# EAGLE design remote_controller (EAGLE 9.0.1)
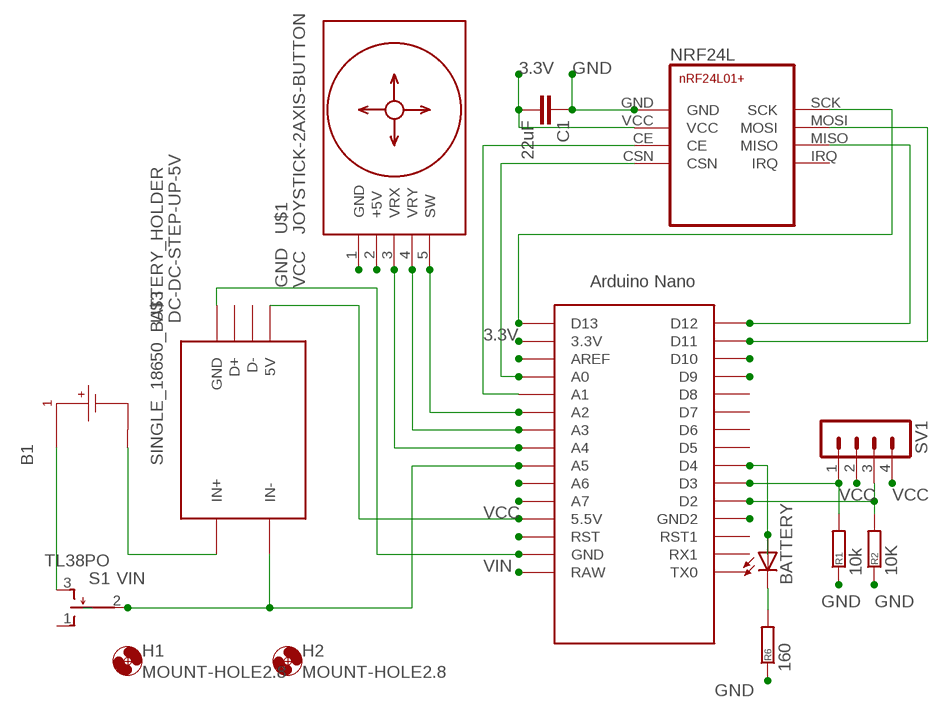
[diagram p0: schematic, sheet 1]

## Parts
B1  SINGLE_18650_BATTERY_HOLDER  [SINGLE_18650_HOLDER]
BATTERY  LED5MM  [LED5MM]
C1  22uF  C-EU025-040X050  [C025-040X050]
H1  MOUNT-HOLE2.8  [2,8]
H2  MOUNT-HOLE2.8  [2,8]
NRF24L  NRF24L01+  [NRF24L01+]
R1  10k  R-EU_0204/7  [0204/7]
R2  10K  R-EU_0204/7  [0204/7]
R6  160  R-EU_0204/7  [0204/7]
S1  TL38PO  [TL3XPO]
SV1  MA04-1  [MA04-1]
U$1  JOYSTICK-2AXIS-BUTTON  [JOYSTICK-2AXIS-BUTTON]
U$2  NANO  [NANO]
U$3  DC-DC-STEP-UP-5V  [DC-DC-STEP-UP-5V]

## Nets
3.3V: C1.2 NRF24L.VCC U$2.3.3V
A0: NRF24L.CSN U$2.A0
A1: NRF24L.CE U$2.A1
A2: U$1.5(SW) U$2.A2
A3: U$1.4(VRY) U$2.A3
A4: U$1.3(VRX) U$2.A4
D2: R2.2 SV1.3 U$2.D2
D3: R1.2 SV1.1 U$2.D3
D4: BATTERY.A U$2.D4
D9: U$2.D9
D10: U$2.D10
D11: NRF24L.MOSI U$2.D11
D12: NRF24L.MISO U$2.D12
D13: NRF24L.SCK U$2.D13
GND: C1.1 NRF24L.GND R1.1 R2.1 R6.1 U$1.1(GND) U$2.GND U$2.GND1(GND2) U$3.GND
N$3: B1.C1_N(1_N) U$3.IN+
N$12: B1.C1_P(1_P) S1.3(S)
N$16: BATTERY.K(C) R6.2
N$18: U$2.RST
N$20: U$2.A7
N$21: U$2.A6
N$30: U$2.AREF
VCC: SV1.2 SV1.4 U$1.2(+5V) U$2.5V(5.5V) U$3.5V
VIN: S1.2(P) U$2.A5 U$2.RAW U$3.IN-
Unconnected: NRF24L.IRQ S1.1(O) U$2.D5 U$2.D6 U$2.D7 U$2.D8 U$2.RST1 U$2.RX1 U$2.TX0 U$3.D+ U$3.D-

## Library data of the parts
B1 = dd_18650:SINGLE_18650_BATTERY_HOLDER: Keystone Electronics 18650 Battery Holder; MANUF: Keystone Electronics; PARTNUM: 1049
BATTERY = dd_led:LED: LED OSRAM: - CHIPLED LG R971, LG N971, LY N971, LG Q971, LY Q971, LO R971, LY R971 LH N974, LH R974 LS Q976, LO Q976, LY Q976 LO Q996 - Hyper CHIPLED LW Q18S LB Q993, LB Q99A, LB R99A - SideLED LS A670, LO A670, LY A670, LG A670, LP A670 LB A673, LV A673, LT A673, LW A673 LH A674 LY A675 LS A676, LA A676, LO A676, LY A676, LW A676 LS A679, LY A679, LG A679 - Hyper Micro SIDELED® LS Y876, LA Y876, LO Y876, LY Y876 LT Y87S - SmartLED LW L88C, LW L88S LB L89C, LB L89S, LG L890 LS L89K, LO L89K, LY L89K LS L896, LA L896, LO L896, LY L896 - TOPLED LS T670, LO T670, LY T670, LG T670, LP T670 LSG T670, LSP T670, LSY T670, LOP T670, LYG T670 LG T671, LOG T671, LSG T671 LB T673, LV T673, LT T673, LW T673 LH T674 LS T676, LA T676, LO T676, LY T676, LB T676, LH T676, LSB T676, LW T676 LB T67C, LV T67C, LT T67C, LS T67K, LO T67K, LY T67K, LW E67C LS E67B, LA E67B, LO E67B, LY E67B, LB E67C, LV E67C, LT E67C LW T67C LS T679, LY T679, LG T679 LS T770, LO T770, LY T770, LG T770, LP T770 LB T773, LV T773, LT T773, LW T773 LH T774 LS E675, LA E675, LY E675, LS T675 LS T776, LA T776, LO T776, LY T776, LB T776 LHGB T686 LT T68C, LB T68C - Hyper Mini TOPLED® LB M676 - Mini TOPLED Santana® LG M470 LS M47K, LO M47K, LY M47K Source: http://www.osram.convergy.de LUXEON: - LUMILED® LXK2-PW12-R00, LXK2-PW12-S00, LXK2-PW14-U00, LXK2-PW14-V00 LXK2-PM12-R00, LXK2-PM12-S00, LXK2-PM14-U00 LXK2-PE12-Q00, LXK2-PE12-R00, LXK2-PE12-S00, LXK2-PE14-T00, LXK2-PE14-U00 LXK2-PB12-K00, LXK2-PB12-L00, LXK2-PB12-M00, LXK2-PB14-N00, LXK2-PB14-P00, LXK2-PB14-Q00 LXK2-PR12-L00, LXK2-PR12-M00, LXK2-PR14-Q00, LXK2-PR14-R00 LXK2-PD12-Q00, LXK2-PD12-R00, LXK2-PD12-S00 LXK2-PH12-R00, LXK2-PH12-S00 LXK2-PL12-P00, LXK2-PL12-Q00, LXK2-PL12-R00 Source: www.luxeon.com KINGBRIGHT: KA-3528ASYC Source: www.kingbright.com
C1 = dd_goldpin:C-EU: CAPACITOR, European symbol
H1 H2 = holes:MOUNT-HOLE: MOUNTING HOLE with drill center marker
NRF24L = dd_nrf:NRF24L01+: nRF24L01+ Transceiver Module
R1 R2 R6 = dd_resistor:R-EU_: RESISTOR, European symbol
S1 = dd_goldpin:TL38PO: TINY SWITCH ON OFF MOM Source: http://www2.produktinfo.conrad.com/datenblaetter/700000-724999/705152-da-01-de-Subminiaturschalter_TL_36YO.pdf
SV1 = dd_goldpin:MA04-1: PIN HEADER; OC_FARNELL: unknown; OC_NEWARK: unknown
U$1 = dd_stepup_joystick:JOYSTICK-2AXIS-BUTTON: 2-Axis Analog Joystick with Push Button Tutorial is available here: http://henrysbench.capnfatz.com/henrys-bench/arduino-sensors-and-input/arduino-ps2-joystick-tutorial-keyes-ky-023-deek-robot/ Click here to find device on ebay.com <http://www.ebay.com/sch/joystick+ps2+module>
U$2 = dd_nano:NANO: Arduino Nano
U$3 = dd_stepup_joystick:DC-DC-STEP-UP-5V: DC/DC Step-Up Converter

## Board
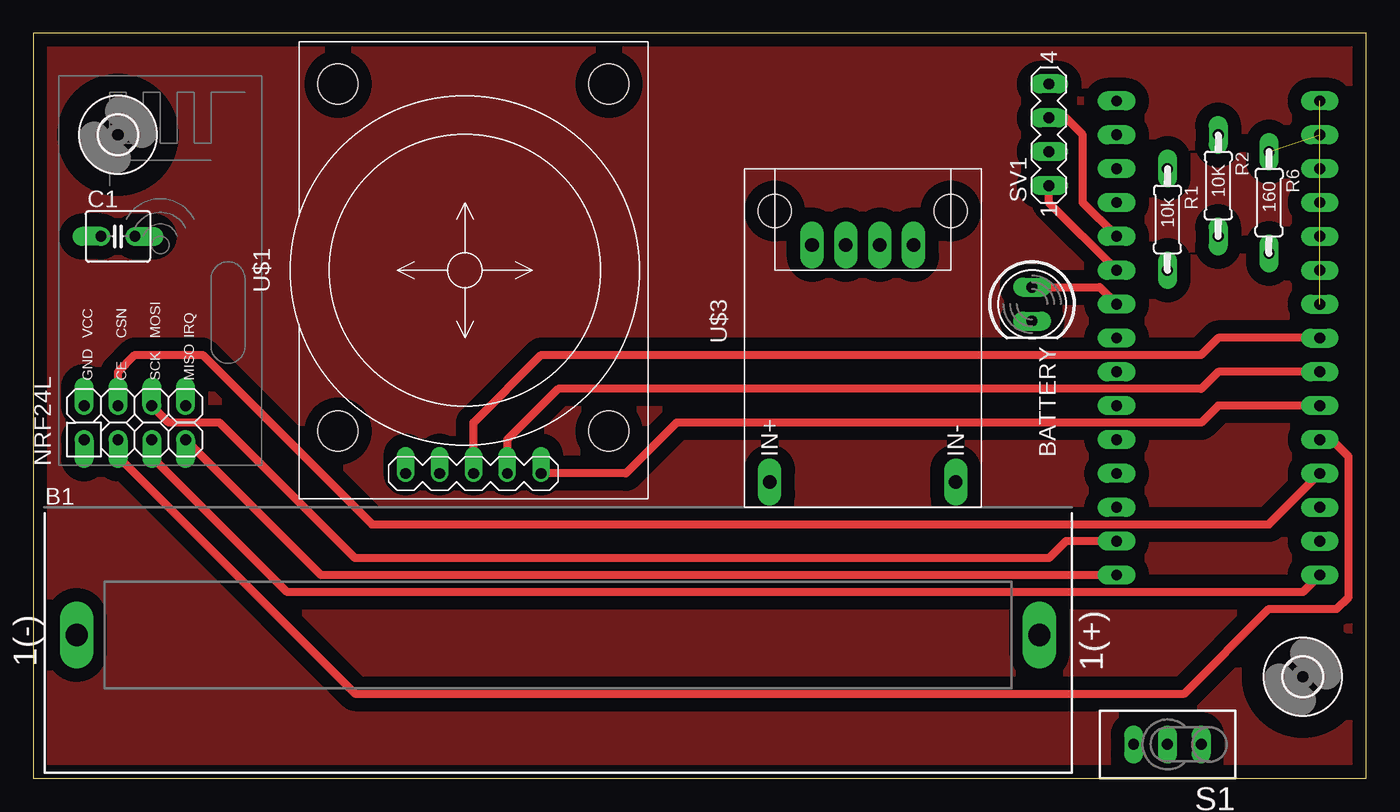
[diagram p1: board, top side]
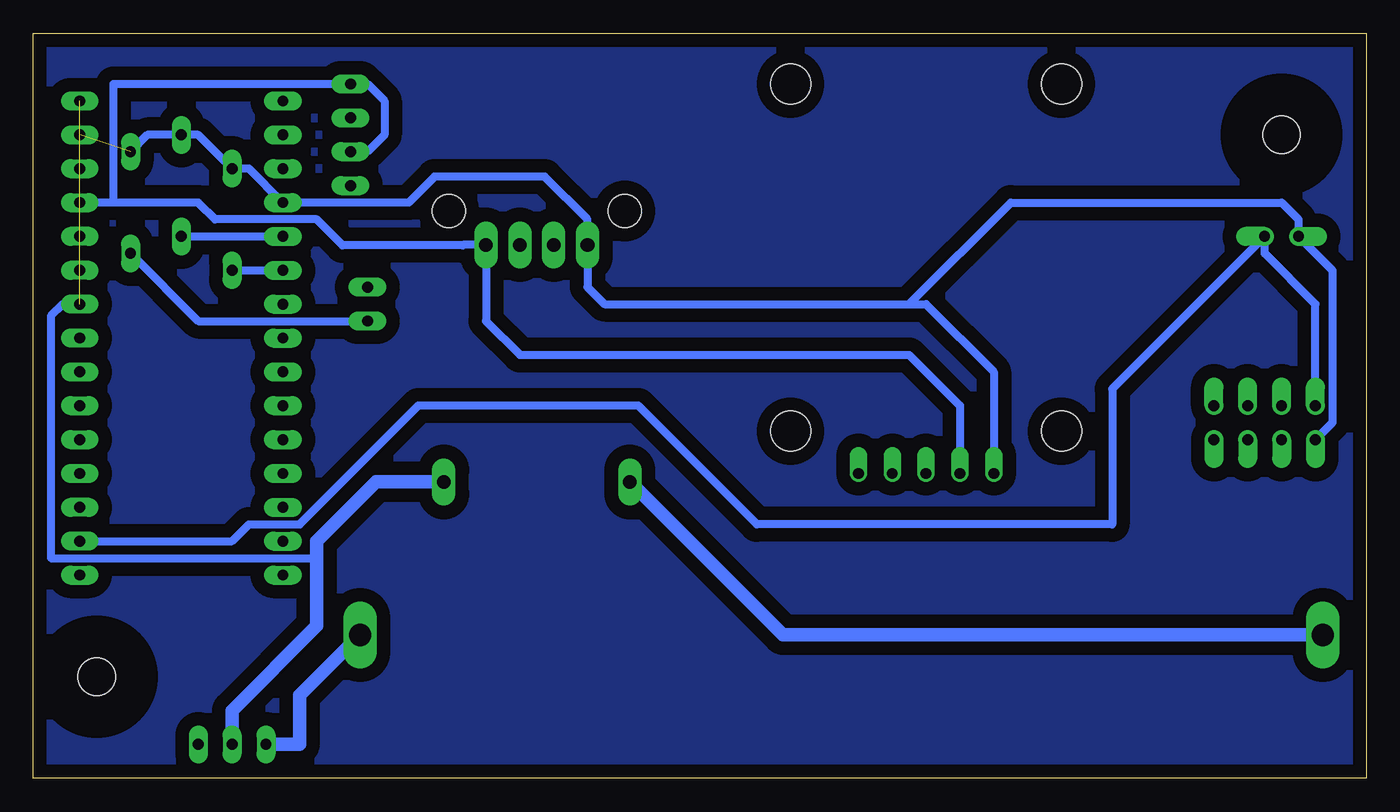
[diagram p2: board, bottom side, seen from below]

Size 100 x 55.87 mm. Coordinates in mm from the lower left corner, seen from the top.
Outline: 0,0 100,0 100,55.87 0,55.87 0,0
Copper layers (1*16): Top 0.035mm / dielectric 1.5mm / Bottom 0.035mm
Design rules "default": minimum track width 6mil, minimum drill 0.35mm, track to track 6mil, track to pad 6mil, pad to pad 6mil, via to via 6mil, smd to smd 6mil, copper to edge 40mil, drill to drill 6mil, minimum pad ring 10mil, minimum via ring 8mil, stop-mask expansion 4mil, vias tented up to drill 0mil, thermal gap 10mil

### Footprints (pad centres in the part's own frame; a part is rotated, then mirrored left to right if it is on the bottom)
SINGLE_18650_HOLDER = drill 1.676 pad 2.184 long: C1_N -36.11,-9.565; C1_P 36.11,-9.565
LED5MM = drill 0.813 pad 1.422 long: A -1.27,0; K 1.27,0
C025-040X050 = drill 0.813 pad 1.422 offset: 1 -1.27,0; 2 1.27,0
2,8 = hole 2.8: 0,0
NRF24L01+ = drill 0.813 pad 1.422 offset: CE -11.43,1.27; CSN -8.89,1.27; GND -11.43,3.81; IRQ -8.89,-3.81; MISO -11.43,-3.81; MOSI -8.89,-1.27; SCK -11.43,-1.27; VCC -8.89,3.81
0204/7 = drill 0.813 pad 1.422 long: 1 -3.81,0; 2 3.81,0
TL3XPO = drill 0.813 pad 1.422 long: 1 -2.54,0; 2 0,0; 3 2.54,0
MA04-1 = drill 0.813 pad 1.422 long: 1 -3.81,0; 2 -1.27,0; 3 1.27,0; 4 3.81,0
JOYSTICK-2AXIS-BUTTON = drill 0.813 offset: 1 -15.24,5.08; 2 -15.24,2.54; 3 -15.24,0; 4 -15.24,-2.54; 5 -15.24,-5.08 | hole 3: -12.065,10.16; -12.065,-10.16; 13.97,-10.16; 13.97,10.16
NANO = drill 0.813 pad 1.422 long: 3.3V -10.16,24.13; 5V -10.16,-1.27; A0 -10.16,19.05; A1 -10.16,16.51; A2 -10.16,13.97; A3 -10.16,11.43; A4 -10.16,8.89; A5 -10.16,6.35; A6 -10.16,3.81; A7 -10.16,1.27; AREF -10.16,21.59; D2 5.08,1.27; D3 5.08,3.81; D4 5.08,6.35; D5 5.08,8.89; D6 5.08,11.43; D7 5.08,13.97; D8 5.08,16.51; D9 5.08,19.05; D10 5.08,21.59; D11 5.08,24.13; D12 5.08,26.67; D13 -10.16,26.67; GND -10.16,-6.35; GND1 5.08,-1.27; RAW -10.16,-8.89; RST -10.16,-3.81; RST1 5.08,-3.81; RX1 5.08,-6.35; TX0 5.08,-8.89
DC-DC-STEP-UP-5V = drill 1.016 pad 1.778 long: 5V 6.985,-3.81; D+ 6.985,1.27; D- 6.985,-1.27; GND 6.985,3.81; IN+ -10.795,6.985; IN- -10.795,-6.985 | hole 2.5: 9.525,6.604; 9.525,-6.604

### Placement (x,y rotation side)
B1  39.37,20.32 0 top
BATTERY  74.93,35.56 270 top
C1  6.35,40.64 0 top
H1  95.25,7.62 0 top
H2  6.35,48.26 0 top
NRF24L  7.62,36.83 90 top
R1  85.09,41.91 270 top
R2  88.9,44.45 270 top
R6  92.71,43.18 270 top
S1  85.09,2.54 180 top
SV1  76.2,48.26 90 top
U$1  33.02,38.1 90 top
U$2  86.36,41.91 180 top
U$3  62.23,33.02 90 top

### Tracks (layer width: path | path; a pad name or v marks a point on that pad's centre or on a via)
3.3V
  Bottom 0.61: NRF24L.VCC 3.81,35.56 7.62,39.37 C1.2 19.05,29.21 19.05,19.05 45.72,19.05 54.61,27.94 71.12,27.94 80.01,19.05 83.82,19.05 85.09,17.78 U$2.3.3V
A0
  Top 0.61: NRF24L.CSN 6.35,30.48 7.62,31.75 12.7,31.75 25.4,19.05 92.71,19.05 U$2.A0
A1
  Top 0.61: NRF24L.CE 6.35,24.13 24.13,6.35 86.36,6.35 92.71,12.7 97.79,12.7 98.68,13.59 98.68,24.13 97.41,25.4 U$2.A1
A2
  Top 0.61: U$1.5 44.45,22.86 48.26,26.67 87.63,26.67 88.9,27.94 U$2.A2
A3
  Top 0.61: U$1.4 35.56,25.4 39.37,29.21 87.63,29.21 88.9,30.48 U$2.A3
A4
  Top 0.61: U$2.A4 88.9,33.02 87.63,31.75 38.1,31.75 33.02,26.67 U$1.3
D2
  Top 0.61: U$2.D2 78.74,43.18 78.74,48.26 77.47,49.53 SV1.3
  Bottom 0.61: R2.2 U$2.D2
D3
  Top 0.61: U$2.D3 76.2,43.18 SV1.1
  Bottom 0.61: R1.2 U$2.D3
D4
  Top 0.61: BATTERY.A 80.01,36.83 U$2.D4
D11
  Top 0.61: U$2.D11 77.47,17.78 76.2,16.51 24.13,16.51 13.97,26.67 10.16,26.67 NRF24L.MOSI
D12
  Top 0.61: U$2.D12 21.59,15.24 NRF24L.MISO
D13
  Top 0.61: U$2.D13 95.25,13.97 19.05,13.97 8.89,24.13 NRF24L.SCK
GND  (1 unrouted)
  Bottom 0.61: 34.29,35.56 57.15,35.56 58.42,36.83 U$3.GND 58.42,41.91 61.63,45.12 69.9,45.12 71.83,43.18 U$2.GND1 83.82,45.72 R1.1 87.63,48.26 R2.1 91.44,48.26 R6.1 | 34.29,35.56 33.02,35.56 27.94,30.48 U$1.1 | 34.29,35.56 26.67,43.18 6.35,43.18 5.08,41.91 C1.1 2.54,38.1 2.54,26.67 NRF24L.GND
N$1
  pour Bottom (isolate 1.016): 0,55.88 100.33,55.88 100.33,0 0,0
N$2
  pour Top (isolate 1.016): 0,55.88 100.33,55.88 100.33,0 0,0
N$3
  Bottom 1.016: B1.C1_N 43.77,10.76 U$3.IN+
N$12
  Bottom 1.016: B1.C1_P 80.01,6.22 80.01,2.54 S1.3
N$16
  Bottom 0.61: R6.2 87.63,34.29 BATTERY.K
VCC
  Bottom 0.61: 93.98,43.18 87.63,43.18 86.36,41.91 78.74,41.91 76.8,39.97 67.77,39.97 67.74,40.01 U$3.5V 66.04,34.29 63.5,31.75 34.29,31.75 30.48,27.94 U$1.2 | 93.98,43.18 U$2.5V | 93.98,43.18 93.98,52.07 SV1.4 74.93,52.07 73.66,50.8 73.66,48.26 74.93,46.99 SV1.2
VIN  (1 unrouted)
  Bottom 0.61: U$2.A5 97.79,35.56 98.68,34.67 98.68,16.51 78.74,16.51
  Bottom 1.016: S1.2 85.09,5.08 78.74,11.43 78.74,16.51 78.74,17.78 74.3,22.23 U$3.IN-